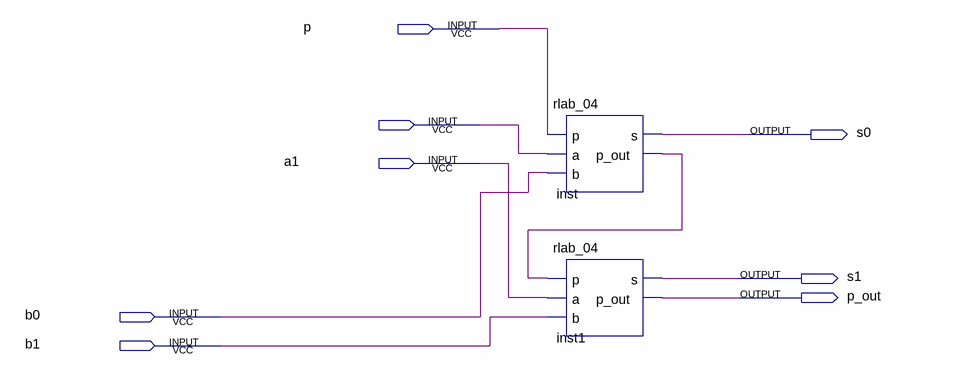
[diagram p0: schematic sheet]
// Quartus schematic sum_2.bdf as structural Verilog: 2 symbols, 8 pins
module sum_2 (
  input  p,
  input  a1,
  input  b0,
  input  b1,
  output s0,
  output s1,
  output p_out
);

  wire inst_p_out, undriven;

  rlab_04 inst (.p(p), .a(undriven), .b(b0), .s(s0), .p_out(inst_p_out));
  rlab_04 inst1 (.p(inst_p_out), .a(a1), .b(b1), .s(s1), .p_out(p_out));
endmodule
